# Altium project LAB3all.PrjPcb
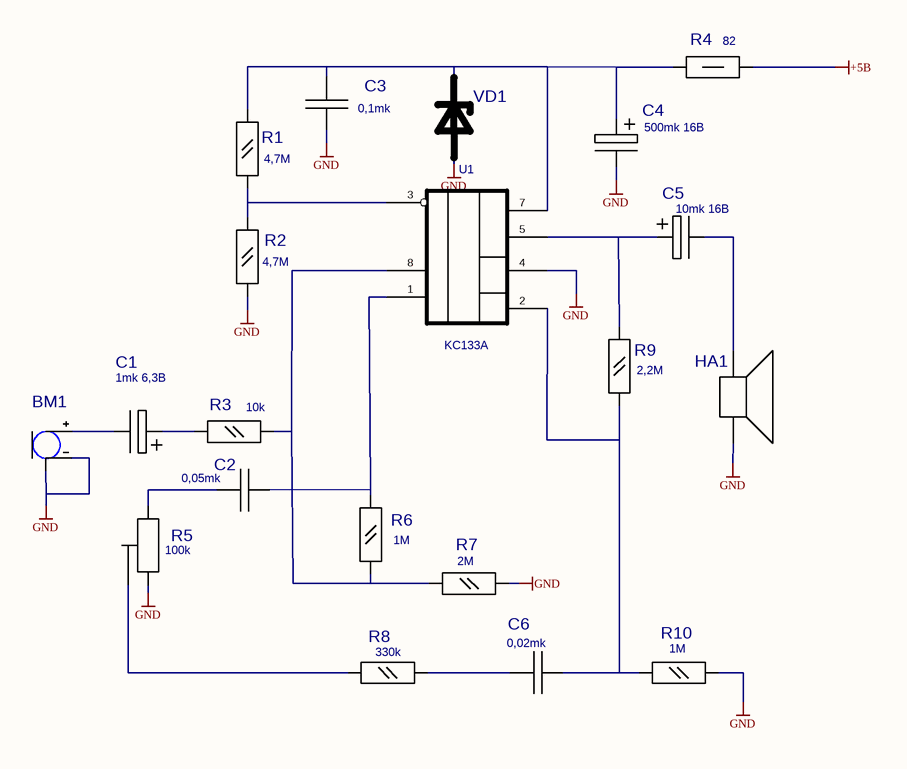
[diagram p0: Sheet1.SCHDOC]
1 sheet, 20 parts. Net scope: global (net labels, ports and power ports of the same name join across sheets).

## Sheet Sheet1.SCHDOC
size 297 x 209 mm; SheetNumber: 1; SheetTotal: 1; DocumentName: Sheet1.SCHDOC

### Parts
BM1  M11  [M11]  (value not drawn)
C1  value 1mk 6,3B  [B43505-3550]  (hidden comment: B43505-470ÌÊÔ-400Â-3550)
C2  value 0,05mk  [B32921(13X4)]  (hidden comment: B32921-C3103-0,01UF)
C3  value 0,1mk  [B32921(13X4)]  (hidden comment: B32921-C3103-0,01UF)
C4  value 500mk 16B  [B43505-3550]  (hidden comment: B43505-470ÌÊÔ-400Â-3550)
C5  value 10mk 16B  [B43505-3550]  (hidden comment: B43505-470ÌÊÔ-400Â-3550)
C6  value 0,02mk  [B32921(13X4)]  (hidden comment: B32921-C3103-0,01UF)
HA1  0,25ÃÄ-10  [0,25ÃÄ-10]  (value not drawn)
R1  value 4,7M  [C2-33H-0.125W]  (hidden comment: C2-33H-0.125W_OLD_UGO)
R2  value 4,7M  [C2-33H-0.125W]  (hidden comment: C2-33H-0.125W_OLD_UGO)
R3  value 10k  [C2-33H-0.125W]  (hidden comment: C2-33H-0.125W_OLD_UGO)
R4  value 82  [C2-33H-0.5W_15MM]  (hidden comment: C2-33H-0.5W_OLD_UGO)
R5  value 100k  [16K1]  (hidden comment: 16K1)
R6  value 1M  [C2-33H-0.125W]  (hidden comment: C2-33H-0.125W_OLD_UGO)
R7  value 2M  [C2-33H-0.125W]  (hidden comment: C2-33H-0.125W_OLD_UGO)
R8  value 330k  [C2-33H-0.125W]  (hidden comment: C2-33H-0.125W_OLD_UGO)
R9  value 2,2M  [C2-33H-0.125W]  (hidden comment: C2-33H-0.125W_OLD_UGO)
R10  value 1M  [C2-33H-0.125W]  (hidden comment: C2-33H-0.125W_OLD_UGO)
U1  KC133A  [KC133A]
VD1  1N4728A  [DO-41(DO-204AL)]  (value not drawn)

### Nets
+5B: R4.2
GND: BM1.1(OUT) BM1.2(GND) C3.2 C4.2 HA1.2 R2.1 R5.2 R7.1 R10.1 U1.4 VD1.1(A)
NetBM1_3: BM1.3(VDD) C1.2
NetC1_1: C1.1 R3.2
NetC2_1: C2.1 R5.1
NetC2_2: C2.2 R6.1 U1.1
NetC3_1: C3.1 C4.1 R1.2 R4.1 U1.7 VD1.2(K)
NetC5_1: C5.1 R9.2 U1.5
NetC5_2: C5.2 HA1.1
NetC6_1: C6.1 R8.1
NetC6_2: C6.2 R9.1 R10.2 U1.2
NetR1_1: R1.1 R2.2 U1.3
NetR3_1: R3.1 R6.2 R7.2 U1.8
NetR5_3: R5.3 R8.2

Not connected (* = marked no-connect by the designer): BM1 4 5 6 7; C1 3; C4 3; C5 3; HA1 3 4 5 6

### Library data of the parts
R1-R3 R6-R10 = C2-33H-0.125W_OLD_UGO: Autor: pcbdesigner.ru
R4 = C2-33H-0.5W_OLD_UGO: Autor: pcbdesigner.ru
BM1 = M11: Value: *
HA1 = 0,25ÃÄ-10: Value: *
U1 = KC133A: Value: *
VD1 = 1N4728A: Value: *